# Altium schematic sheet Sheet1.SchDoc
size A4; SheetNumber: 1; SheetTotal: 1
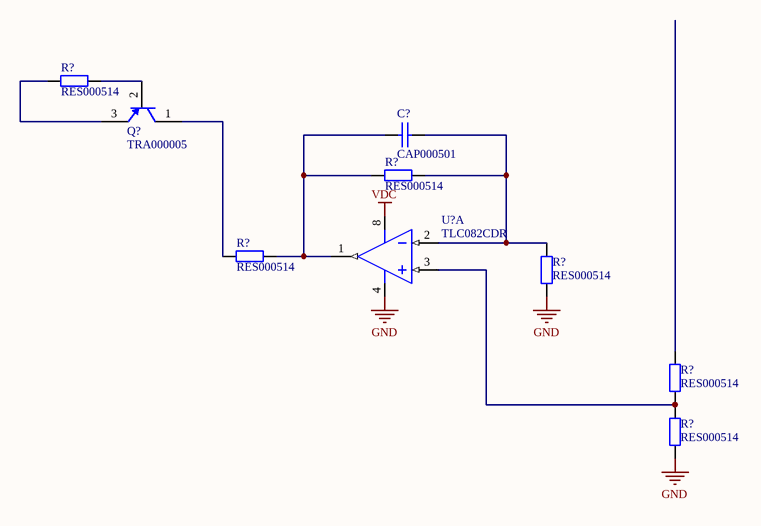
[diagram p0: Sheet1.SchDoc]

## Parts
(Parts that share a designator on the sheet are numbered #1, #2 ... from top to bottom, then left to right.)
C?  CAP000501  [ECE-CAPC2012-0805SM]
Q?  TRA000005  [ECE-TO-92TH]
R?#1  RES000514  [ECE-RESC2012-0805SM]
R?#2  RES000514  [ECE-RESC2012-0805SM]
R?#3  RES000514  [ECE-RESC2012-0805SM]
R?#4  RES000514  [ECE-RESC2012-0805SM]
R?#5  RES000514  [ECE-RESC2012-0805SM]
R?#6  RES000514  [ECE-RESC2012-0805SM]
U?  TLC082CDR  [SOIC8-Ti-Footprint]  (part A of 2)

## Nets
GND: R?#4.1 R?#6.1 U?.4(GND)
VDC: U?.8(VCC)
NetC?_1: C?.1 R?#2.1 R?#3.2 U?.1(1OUT)
NetC?_2: C?.2 R?#2.2 R?#4.2 U?.2(1IN-)
NetQ?_1: Q?.1(C) R?#3.1
NetQ?_2: Q?.2(B) R?#1.2
NetQ?_3: Q?.3(E) R?#1.1
NetR?#5_2: R?#5.2 R?#6.2 U?.3(1IN+)

Not connected (* = marked no-connect by the designer): R?#5 1

## Library data of the parts
C? = CMP-039-000114-1: CAP CER 10pF 50V NPO SM0805; Manufacturer-PN: CL21C100JBANNNC; Manufactuer: Samsung; Assembly Method: Surface Mount; Item Type: Item; Path: ece/ts/Lists/Stock Inventory; Category: Capacitor; Component Type: CAP-0805-10pF; Supplier1-PN: 1276-1109-2-ND; UoA Stock#: CAP000501; Value: 10pF; Status: Active; Size/Package: 0805 (2012 Metric); Supplier1: Digikey; Voltage/Current: 50V
Q? = CMP-054-000004-1: BC557B PNP Transistor TH; Manufactuer: Multicomp; Item Type: Item; Path: ece/ts/Lists/Stock Inventory; Assembly Method: Through hole; Voltage/Current: 45V/100mA; Datasheet Link: http://share.engineering.auckland.ac.nz/ece/ts/Student%20Documents/BC557B_transistor.pdf; Category: Transistor; Supplier2: Active components; Value: BC557B; Supplier1: Element 14; Manufacturer-PN: BC557B; Size/Package: TO-92; Component Type: NA; Supplier2-PN: BC557; Status: Active; Supplier1-PN: 437-840; UoA Stock#: TRA000005
R?#1-R?#6 = CMP-052-000184-1: RES CER 10R 2012 SM; Item Type: Item; Value: 10; Voltage/Current: 1/8W; Assembly Method: Surface Mount; Path: ece/ts/Lists/Stock Inventory; Category: Resistor; Component Type: RES-2012-10R; UoA Stock#: RES000514; Size/Package: 2012 (0805); Status: Active
U? = CMP-001-0003-1: Dual 3pA 19V/us 10MHz 1900uV SOIC-8 Operational Amplifier; Common Mode Rejection Ratio: 80dB; Max Supply Voltage: 16V; Number of Amplifiers: 2; Output Current: 57mA; Input Bias Current: 50pA; Input Offset Voltage (Vos): 1.9mV; Slew Rate: 16V/µs; Gain Bandwidth Product: 10MHz; Bandwidth: 10MHz; Case/Package: SOIC